# Altium schematic sheet LCD.SchDoc
size A
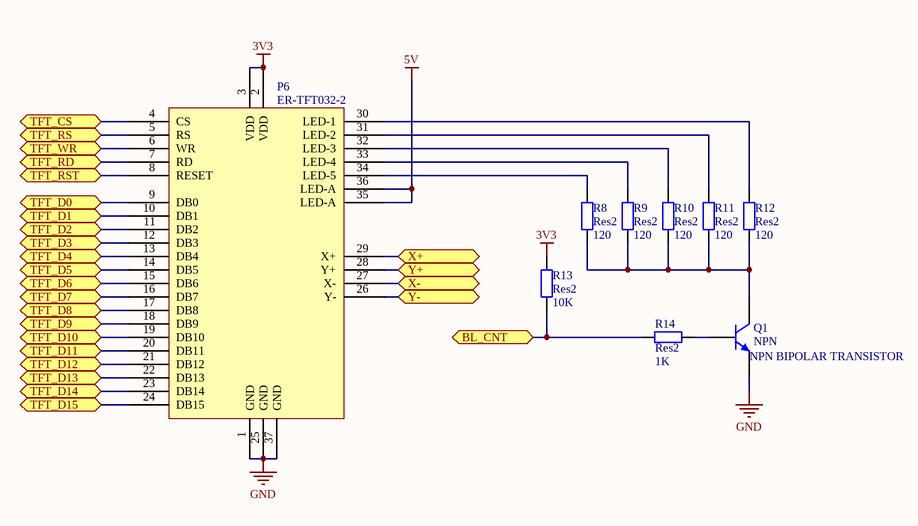
[diagram p0: LCD.SchDoc]

## Parts
P6  ER-TFT032-2  [ER-TFT032-2]
Q1  NPN  value NPN BIPOLAR TRANSISTOR  [SOT23_M]
R8  Res2  value 120  [0603]
R9  Res2  value 120  [0603]
R10  Res2  value 120  [0603]
R11  Res2  value 120  [0603]
R12  Res2  value 120  [0603]
R13  Res2  value 10K  [0603]
R14  Res2  value 1K  [0603]

## Ports
BL_CNT, TFT_CS, TFT_D0, TFT_D1, TFT_D2, TFT_D3, TFT_D4, TFT_D5, TFT_D6, TFT_D7, TFT_D8, TFT_D9, TFT_D10, TFT_D11, TFT_D12, TFT_D13, TFT_D14, TFT_D15, TFT_RD, TFT_RS, TFT_RST, TFT_WR, X+, X-, Y+, Y-

## Nets
3V3: P6.2(VDD) P6.3(VDD) R13.2
5V: P6.35(LED-A) P6.36(LED-A)
GND: P6.1(GND) P6.25(GND) P6.37(GND) Q1.3(E)
BL_CNT: R13.1 R14.2 ; port BL_CNT
TFT_CS: P6.4(CS) ; port TFT_CS
TFT_D0: P6.9(DB0) ; port TFT_D0
TFT_D1: P6.10(DB1) ; port TFT_D1
TFT_D2: P6.11(DB2) ; port TFT_D2
TFT_D3: P6.12(DB3) ; port TFT_D3
TFT_D4: P6.13(DB4) ; port TFT_D4
TFT_D5: P6.14(DB5) ; port TFT_D5
TFT_D6: P6.15(DB6) ; port TFT_D6
TFT_D7: P6.16(DB7) ; port TFT_D7
TFT_D8: P6.17(DB8) ; port TFT_D8
TFT_D9: P6.18(DB9) ; port TFT_D9
TFT_D10: P6.19(DB10) ; port TFT_D10
TFT_D11: P6.20(DB11) ; port TFT_D11
TFT_D12: P6.21(DB12) ; port TFT_D12
TFT_D13: P6.22(DB13) ; port TFT_D13
TFT_D14: P6.23(DB14) ; port TFT_D14
TFT_D15: P6.24(DB15) ; port TFT_D15
TFT_RD: P6.7(RD) ; port TFT_RD
TFT_RS: P6.5(RS) ; port TFT_RS
TFT_RST: P6.8(RESET) ; port TFT_RST
TFT_WR: P6.6(WR) ; port TFT_WR
X+: P6.29(X+) ; port X+
X-: P6.27(X-) ; port X-
Y+: P6.28(Y+) ; port Y+
Y-: P6.26(Y-) ; port Y-
NetP6_30: P6.30(LED-1) R12.2
NetP6_31: P6.31(LED-2) R11.2
NetP6_32: P6.32(LED-3) R10.2
NetP6_33: P6.33(LED-4) R9.2
NetP6_34: P6.34(LED-5) R8.2
NetQ1_1: Q1.1(C) R8.1 R9.1 R10.1 R11.1 R12.1
NetQ1_2: Q1.2(B) R14.1

## Library data of the parts
P6 = ER-TFT032-2: 3.2" TFT LCD module with touch panel
Q1 = NPN: NPN Bipolar Transistor; pin to pad: 2>3 3>2; Supplier Part Number 1: MMBT2222ALT3GOSCT-ND; Supplier 1: Digi-Key
R8-R14 = Res2: Resistor; Supplier 1: Digi-Key
  R8-R12: Supplier Part Number 1: P120GCT-ND
  R13: Supplier Part Number 1: 311-10KGRCT-ND
  R14: Supplier Part Number 1: 311-1.0KGRCT-ND